# Altium schematic sheet UAVCAN LIDAR.SchDoc
size 420 x 297 mm; SheetNumber: 1; SheetTotal: 1
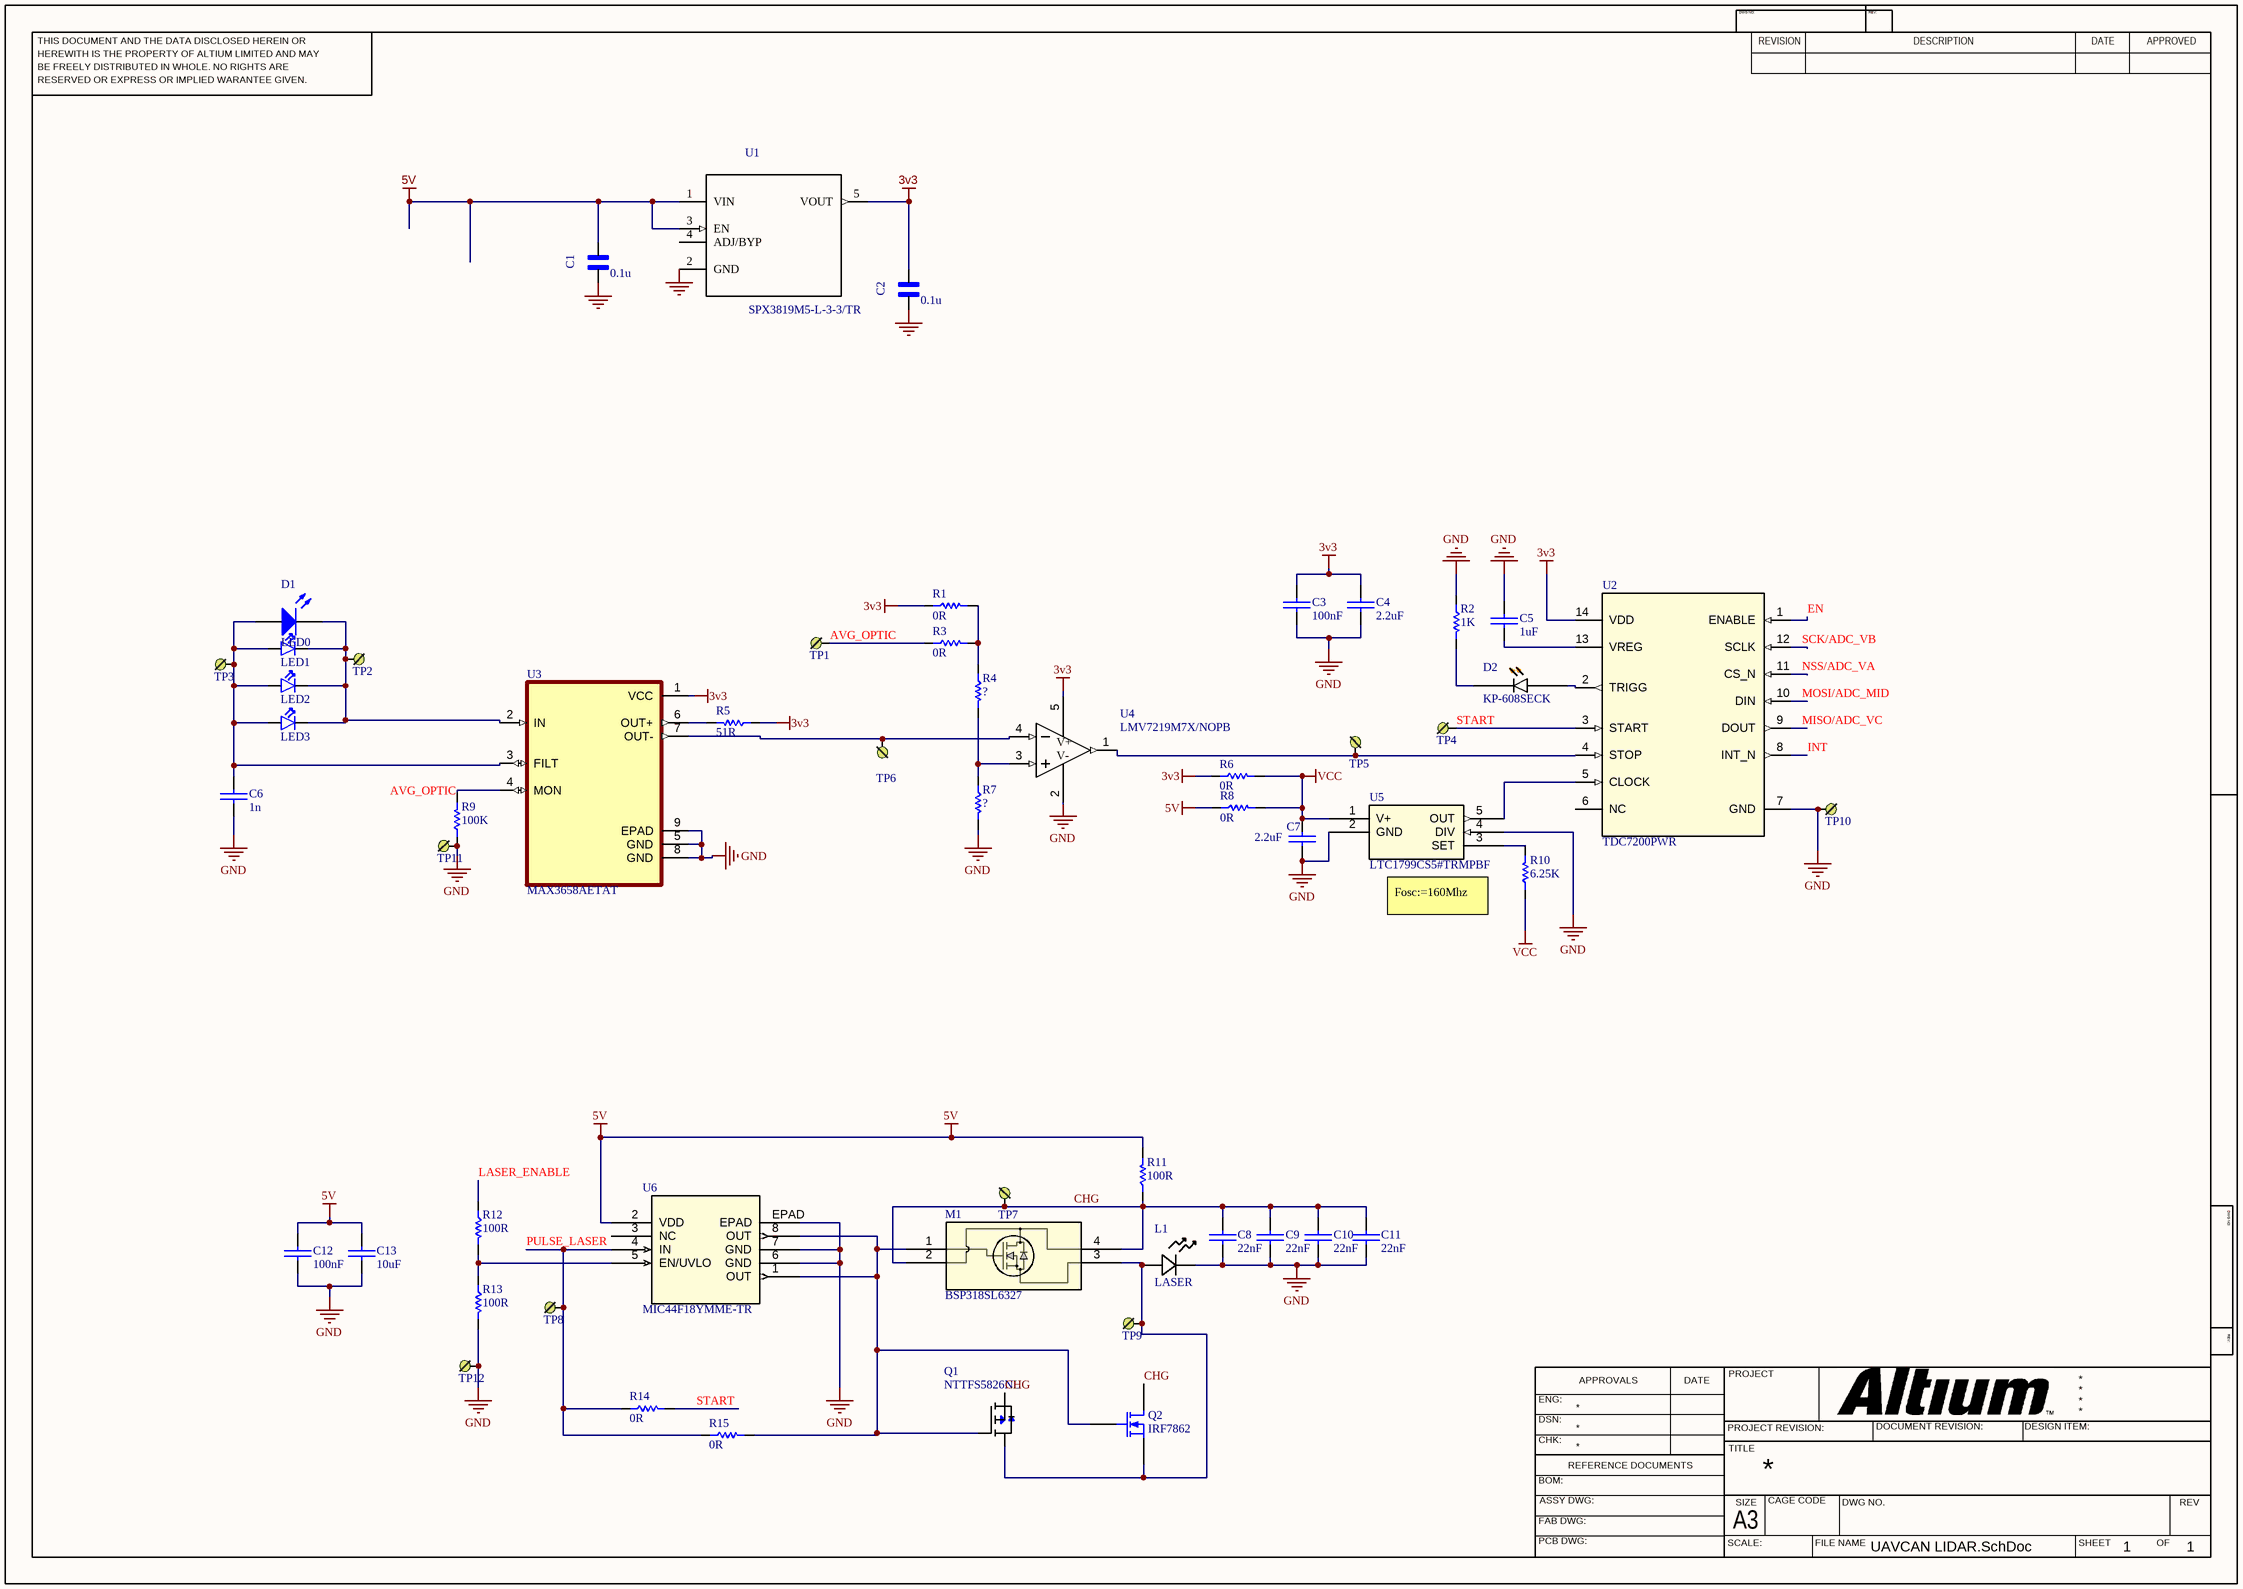
[diagram p0: UAVCAN LIDAR.SchDoc]

## Parts
C1  value 0.1u  [*CAPC1608X90]  (hidden comment: GX035C104MAT2-500)
C2  value 0.1u  [*CAPC1608X90]  (hidden comment: GX035C104MAT2-500)
C3  value 100nF  [SMD_CAP_0603]
C4  value 2.2uF  [SMD_CAP_0603]
C5  value 1uF  [SMD_CAP_0603]
C6  value 1n  [SMD_CAP_0603]
C7  value 2.2uF  [SMD_CAP_0603]
C8  value 22nF  [SMD_CAP_0603]
C9  value 22nF  [SMD_CAP_0603]
C10  value 22nF  [SMD_CAP_0603]
C11  value 22nF  [SMD_CAP_0603]
C12  value 100nF  [SMD_CAP_0603]
C13  value 10uF  [SMD_CAP_0603]
D1  LED0  [LED-0]
D2  KP-608SECK  [*LEDM1608X80_LTE-C1906R-14(Primary)]
L1  LASER  [SPL-PL90]
LED1  LED  [LED1206]  (value not drawn)
LED2  LED  [LED0805]  (value not drawn)
LED3  LED  [LED0603]  (value not drawn)
M1  BSP318SL6327  [PG-SOT223-4_INF-L]
Q1  NTTFS5826NL  [*TRANS_NVTFS015N04CTAG]
Q2  IRF7862  [*SO-08]
R1  0R  [RES 0603 (1608X06L)]
R2  1K  [RES 0603 (1608X06L)]
R3  0R  [RES 0603 (1608X06L)]
R4  ?  [RES 0603 (1608X06L)]
R5  51R  [RES 0603 (1608X06L)]
R6  0R  [RES 0603 (1608X06L)]
R7  ?  [RES 0603 (1608X06L)]
R8  0R  [RES 0603 (1608X06L)]
R9  100K  [RES 0603 (1608X06L)]
R10  6.25K  [RES 0603 (1608X06L)]
R11  100R  [RES 1210 (3226X07L)]
R12  100R  [RES 0603 (1608X06L)]
R13  100R  [RES 0603 (1608X06L)]
R14  0R  [RES 0603 (1608X06L)]
R15  0R  [RES 0603 (1608X06L)]
TP1  Test Point  [PAD1]  (value not drawn)
TP2  Test Point  [PAD1]  (value not drawn)
TP3  Test Point  [PAD1]  (value not drawn)
TP4  Test Point  [PAD1]  (value not drawn)
TP5  Test Point  [PAD1]  (value not drawn)
TP6  Test Point  [PAD1]  (value not drawn)
TP7  Test Point  [PAD1]  (value not drawn)
TP8  Test Point  [PAD1]  (value not drawn)
TP9  Test Point  [PAD1]  (value not drawn)
TP10  Test Point  [PAD1]  (value not drawn)
TP11  Test Point  [PAD1]  (value not drawn)
TP12  Test Point  [PAD1]  (value not drawn)
U1  SPX3819M5-L-3-3/TR  [*SOT95P280X145-5N]
U2  TDC7200PWR  [PW0014A_L]
U3  MAX3658AETAT  [SON65P300X300X80-9N]
U4  LMV7219M7X/NOPB  [SOT-5_S_LIT]
U5  LTC1799CS5#TRMPBF  [SOT-5_S_LIT]
U6  MIC44F18YMME-TR  [SOP65P490X104-9N]

## Nets
3v3: C2.1 C3.1(+) C4.1(+) R1.1 R5.1 R6.1 U1.5(VOUT) U2.14(VDD) U3.1(VCC) U4.5(V+)
5V: C1.1 C12.1(+) C13.1(+) R8.1 R11.2 U1.1(VIN) U1.3(EN) U6.2(VDD)
GND: C1.2 C2.2 C3.2(-) C4.2(-) C5.1(+) C6.2(-) C7.2(-) C8.2(-) C9.2(-) C10.2(-) C11.2(-) C12.2(-) C13.2(-) L1.1 R2.1 R7.2 R9.1 R13.2 TP10.1 TP11.1 TP12.1 U1.2(GND) U2.7(GND) U3.5(GND) U3.8(GND) U3.9(EPAD) U4.2(V-) U5.2(GND) U5.4(DIV) U6.6(GND) U6.7(GND) U6.EPAD
VCC: C7.1(+) R6.2 R8.2 R10.1 U5.1(V+)
AVG_OPTIC: R3.1 R9.2 TP1.1 U3.4(MON)
CHG: C8.1(+) C9.1(+) C10.1(+) C11.1(+) M1.2 M1.4 Q1.S Q2.D R11.1 TP7.1
EN: U2.1(ENABLE)
INT: U2.8(INT_N)
LASER_ENABLE: R12.1
MISO/ADC_VC: U2.9(DOUT)
MOSI/ADC_MID: U2.10(DIN)
NSS/ADC_VA: U2.11(CS_N)
PULSE_LASER: R14.1 R15.1 TP8.1 U6.4(IN)
SCK/ADC_VB: U2.12(SCLK)
START: R14.2 TP4.1 U2.3(START)
NetC5_2: C5.2(-) U2.13(VREG)
NetC6_1: C6.1(+) D1.1(A) LED1.1(A) LED2.1(A) LED3.1(A) TP3.1 U3.3(FILT)
NetD1_2: D1.2(K) LED1.2(K) LED2.2(K) LED3.2(K) TP2.1 U3.2(IN)
NetD2_A: D2.A U2.2(TRIGG)
NetD2_C: D2.C R2.2
NetL1_2: L1.2 M1.3 Q1.D Q2.S TP9.1
NetM1_1: M1.1 Q1.G Q2.G R15.2 U6.1(OUT) U6.8(OUT)
NetR1_2: R1.2 R3.2 R4.1
NetR4_2: R4.2 R7.1 U4.3(IN+)
NetR5_2: R5.2 U3.6(OUT+)
NetR10_2: R10.2 U5.3(SET)
NetR12_2: R12.2 R13.1 U6.5(EN/UVLO)
NetTP5_1: TP5.1 U2.4(STOP) U4.1(OUT)
NetTP6_1: TP6.1 U3.7(OUT-) U4.4(IN-)
NetU2_5: U2.5(CLOCK) U5.5(OUT)

Not connected (* = marked no-connect by the designer): U1 4(ADJ/BYP); U2 6(NC); U6 3(NC)

## Notes on the sheet
- Fosc:=160Mhz
- THIS DOCUMENT AND THE DATA DISCLOSED HEREIN OR
- HEREWITH IS THE PROPERTY OF ALTIUM LIMITED AND MAY
- DWG NO:
- REVISION
- REV:
- DESCRIPTION
- DATE
- APPROVED
- BE FREELY DISTRIBUTED IN WHOLE. NO RIGHTS ARE
- RESERVED OR EXPRESS OR IMPLIED WARANTEE GIVEN.
- ENG:
- APPROVALS
- PROJECT
- DSN:
- CHK:
- REFERENCE DOCUMENTS
- PROJECT REVISION:
- TITLE
- DOCUMENT REVISION:
- DESIGN ITEM:
- BOM:
- FAB DWG:
- PCB DWG:
- ASSY DWG:
- SCALE:
- A3
- SIZE
- CAGE CODE
- FILE NAME
- DWG NO.
- SHEET
- OF
- REV

## Library data of the parts
C1 C2 = GX035C104MAT2-500: Cap Thin Film 0.1uf 50v 0603; MF: AVX; Pacage Metric: 1608; Type: SMD; Package: 0603 AVX; MP: GX035C104MAT2-500; SnapEDA_Link: https://www.snapeda.com/parts/GX035C104MAT2-500/AVX/view-part/?ref=snap
C3-C13 = Cap-Bipolar: Bipolar Capacitor; Voltage: 100V; Designer: Saeid Jorablo; Organazation: ControTec; Adding Date: 1387/12/20
D1 = LED0: Typical INFRARED GaAs LED; Published: 8-Jun-2000; LatestRevisionDate: 08-Jul-2005; LatestRevisionNote: Mech Layer 1 removed.; PackageReference: LED-0; Publisher: Altium Limited; PackageDescription: LED; 2 Leads
D2 = 0603-LED-ORANGE: Orange 605nm LED Indication - Discrete 2.2V 0603 (1608 Metric); MP: SML-D12D1WT86 or LTST-C194KFKT; Type: SMD; Package: 0603 Lite-On; SnapEDA_Link: https://www.snapeda.com/parts/SML-D12D1WT86/Rohm/view-part/?ref=search&t=0603%20LED%20orange; Value: *
L1 = SPL-PL90: 5mm Laser beam transmitter; Designer: EhsanShaghaei; ChipDip_Link: https://www.chipdip.ru/product0/8001775090
LED1-LED3 = LED: Designer :: Razi Research Team Of Mashhad - Hamed Jafarzadeh
M1 = BSP318SL6327: No Description Available; Vendor: Infineon; Built_By: EMA_Cory; SourceLibrary: Add_to_database_2021-03-11; Designer: EhsanShaghaei; Datasheet: https://www.mouser.com/datasheet/2/196/Infineon-BSP318S-DS-v02_04-en-522823.pdf; Manufacturer_Part_Number: BSP318SL6327; Copyright: Copyright (C) 2018 Accelerated Designs. All rights reserved; RefDes: RefDes; Type: DEV; ChipDip_Link: https://www.chipdip.ru/product0/8001781161
Q1 = NTTFS5826NL: NTTFS5826NLTAG, MOSFET N-CHANNEL 60V 20A 24MOHM WDFN8; SnapEDA_Link: https://www.snapeda.com/parts/NVTFS5124PLTAG/ON%20Semiconductor/view-part/?ref=search&t=NVTFS5124PLTAG; Value: *; ChipDip_Link: https://www.chipdip.ru/product/nttfs5826nltag-mosfet-n-channel-60v-20a; HelpURL: http://www.farnell.com/datasheets/2028673.pdf
Q2 = IRF7862: N-Channel MOSFET; Published: 8-Jun-2000; LatestRevisionDate: 17-Jul-2002; LatestRevisionNote: Re-released for DXP Platform.; PackageVersion: 1995/1996; PackageReference: E3; Publisher: Altium Limited; PackageDescription: TO, Flat Index; 3 In-Line, Axial Leads; Body Dia. 4.6mm; Lead Dia. 0.5 mm (max)
R1-R15 = Resistor: Tolerance: 5%; Power: 1/8 W
  R1 R3 R6 R8 R14 R15: Value: 0R
  R2: Value: 1K
  R4 R7: Value: ?
  R5: Value: 51R
  R9: Value: 100K
  R10: Value: 6.25K
  R11-R13: Value: 100R
TP1-TP12 = PLUG
U1 = SPX3819M5-L: Low Dropout Voltage Regulator, Adjustable 0.5A, В±1%, 2.5 to 16 Vin, 5-Pin SOT-23 /; MF: MaxLinear, Inc.; Value: 3V3; MP: SPX3819M5-L-3-3/TR; Package: SOT-23-5 Exar; SnapEDA_Link: https://www.snapeda.com/parts/SPX3819M5-L/MaxLinear%2C%20Inc./view-part/?ref=snap; Type: SMD; ChipDip_Link: https://www.chipdip.ru/product1/8003455237; HelpURL: http://www.farnell.com/datasheets/2614478.pdf
U2 = TDC7200PWR: Designer: Ehsan Shaghaei; ChipDip_Link: https://www.chipdip.ru/product1/8002200734
U3 = MAX3658AETAT: MF: {'manufacturer': u'Maxim Integrated'}; Availability: Unavailable; MP: MAX3658AETAT; Price: None; Value: *; Package: None
U4 = LMV7219M7X/NOPB: Manufacturer: NationalSemiconductor; Characteristics: LMV7219M77nsec27Vto5VcomparatorwithRail-to-RailOutput; CompType: ComparatorIC; TaMin_C: -400; TaMax_C: 850; ComponentLink1DescBC: LMV7219Datasheet; ComponentLink2DescA4: LMV7219WebPage; ComponentLink3DescAC: MAA05APackageWebPage; Designer: EhsanShaghaei; Copyright: Copyright (C) 2018 Accelerated Designs. All rights reserved; SymbolVersion: 2008-07-09; PartNumber: LMV7219M7; PackageDescription: 5LeadSC-70; PackageReference: MAA05A_L; RoHS: O; ComponentLink1URL: http//wwwnationalcom/ds/LM/LMV7219pdf; ComponentLink2URL: http//wwwnationalcom/pf/LM/LMV7219html; ComponentLink3URL: http//wwwnationalcom/packaging/folders/maa05ahtml; Version: B1608; LatestRevisionDate: 2009-03-16; LatestRevisionNote: MassUpdate; Publisher: NationalSemiconductor; Published: 2009-03-16; ChipDip_Link: https://www.chipdip.ru/product0/8005529462; ComponentLink1Description: New link; ComponentLink1URL: *
U5 = LTC1799CS5: Vendor: Linear Technology; Built_By: EMA_UL_Team; SourceLibrary: LinearTech_2016_03_08; Manufacturer_Part_Number: LTC1799CS5#TRMPBF; Copyright: Copyright (C) 2018 Accelerated Designs. All rights reserved; RefDes: RefDes; Type: DEV; ComponentLink1Description: ChipDip_Link; ComponentLink1URL: https://www.chipdip.ru/product1/8002977151; ComponentLink2Description: Designer; ComponentLink2URL: Ehsan Shaghaei
U6 = MIC44F18YMME-TR: No Description Available; Vendor: Microchip; Built_By: EMA_Molly; SourceLibrary: Microchip_2019-09-03; Designer: Ehsan Shaghaei; Manufacturer_Part_Number: MIC44F18YMME-TR; Copyright: Copyright (C) 2018 Accelerated Designs. All rights reserved; RefDes: RefDes; Type: DEV; ChipDip_Link: https://www.chipdip.ru/product/mic44f18ymme